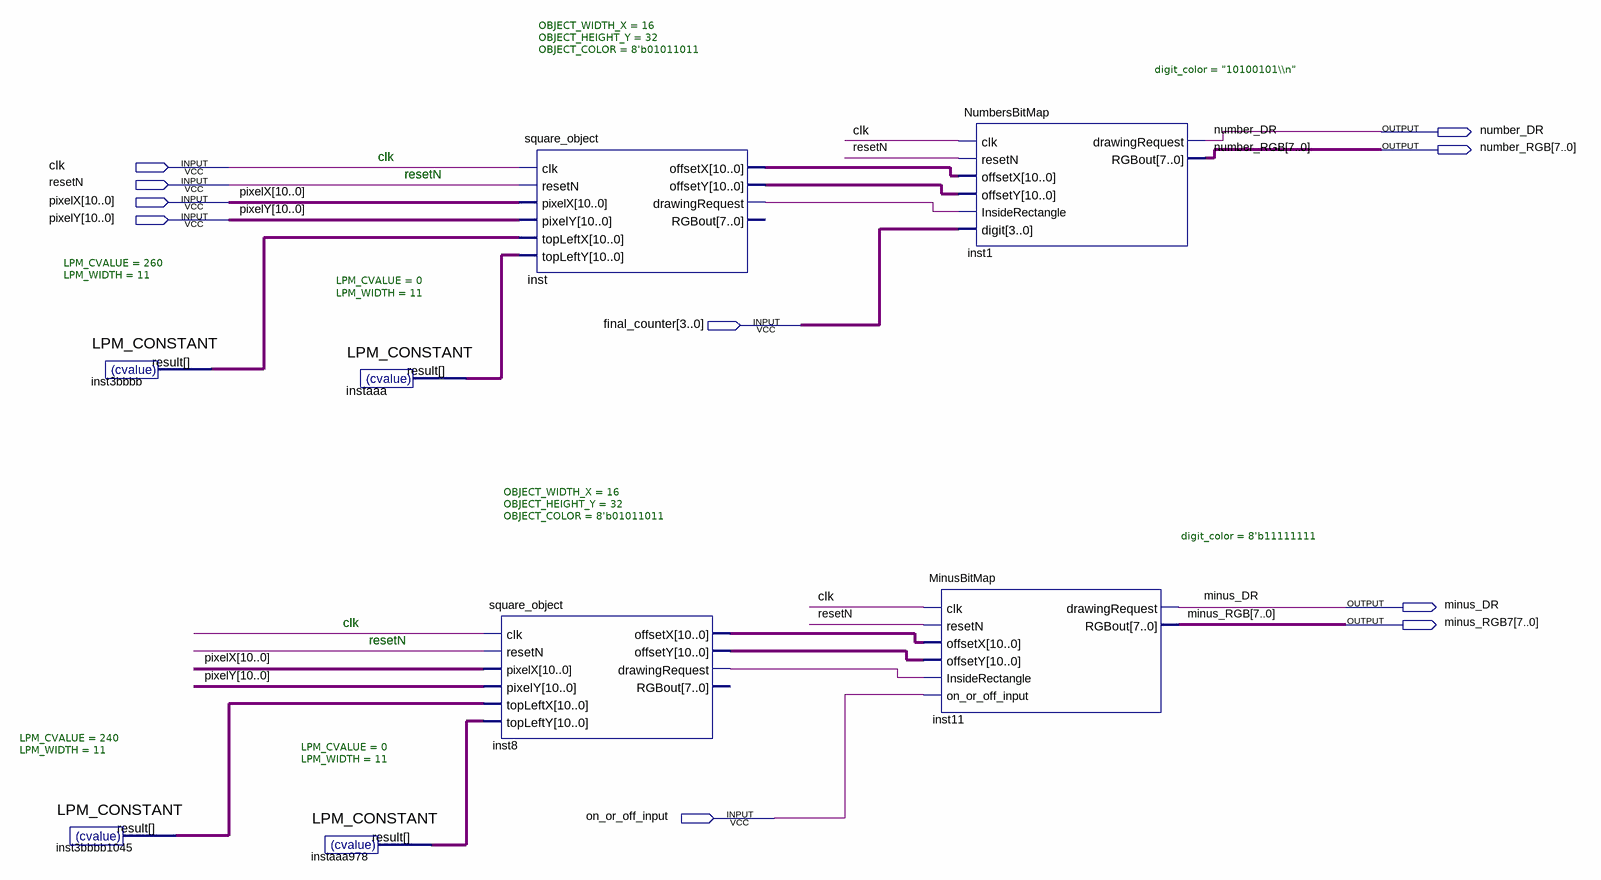
[diagram p0: schematic sheet]
// Quartus schematic numbers_block.bdf as structural Verilog: 8 symbols, 10 pins
module numbers_block (
  input  clk,
  input  resetN,
  input  [10:0] pixelX,
  input  [10:0] pixelY,
  input  [3:0] final_counter,
  input  on_or_off_input,
  output number_DR,
  output [7:0] number_RGB,
  output minus_DR,
  output [7:0] minus_RGB7
);

  wire inst8_drawingrequest, inst_drawingrequest;
  wire [10:0] inst3bbbb1045_result, inst3bbbb_result, inst8_offsetx, inst8_offsety, inst_offsetx,
       inst_offsety, instaaa978_result, instaaa_result;

  LPM_CONSTANT #(.LPM_CVALUE(240), .LPM_WIDTH(11)) inst3bbbb1045 (.result(inst3bbbb1045_result));
  LPM_CONSTANT #(.LPM_CVALUE(260), .LPM_WIDTH(11)) inst3bbbb (.result(inst3bbbb_result));
  LPM_CONSTANT #(.LPM_CVALUE(0), .LPM_WIDTH(11)) instaaa (.result(instaaa_result));
  LPM_CONSTANT #(.LPM_CVALUE(0), .LPM_WIDTH(11)) instaaa978 (.result(instaaa978_result));
  square_object #(.OBJECT_WIDTH_X(16), .OBJECT_HEIGHT_Y(32), .OBJECT_COLOR(8'b01011011)) inst8 (
    .clk(clk), .resetN(resetN), .pixelX(pixelX), .pixelY(pixelY), .topLeftX(inst3bbbb1045_result),
    .topLeftY(instaaa978_result), .offsetX(inst8_offsetx), .offsetY(inst8_offsety),
    .drawingRequest(inst8_drawingrequest));  // open: RGBout
  square_object #(.OBJECT_WIDTH_X(16), .OBJECT_HEIGHT_Y(32), .OBJECT_COLOR(8'b01011011)) inst (
    .clk(clk), .resetN(resetN), .pixelX(pixelX), .pixelY(pixelY), .topLeftX(inst3bbbb_result),
    .topLeftY(instaaa_result), .offsetX(inst_offsetx), .offsetY(inst_offsety),
    .drawingRequest(inst_drawingrequest));  // open: RGBout
  NumbersBitMap #(.digit_color("10100101\\n")) inst1 (
    .clk(clk), .resetN(resetN), .offsetX(inst_offsetx), .offsetY(inst_offsety),
    .InsideRectangle(inst_drawingrequest), .digit(final_counter), .drawingRequest(number_DR),
    .RGBout(number_RGB));
  MinusBitMap #(.digit_color(8'b11111111)) inst11 (
    .clk(clk), .resetN(resetN), .offsetX(inst8_offsetx), .offsetY(inst8_offsety),
    .InsideRectangle(inst8_drawingrequest), .on_or_off_input(on_or_off_input), .drawingRequest(minus_DR),
    .RGBout(minus_RGB7));

  // Other names for the same wires on the sheet: minus_RGB[7:0] = minus_RGB7

  // Notes on the sheet:
  //   clk
  //   resetN
  //   clk
  //   resetN
endmodule
